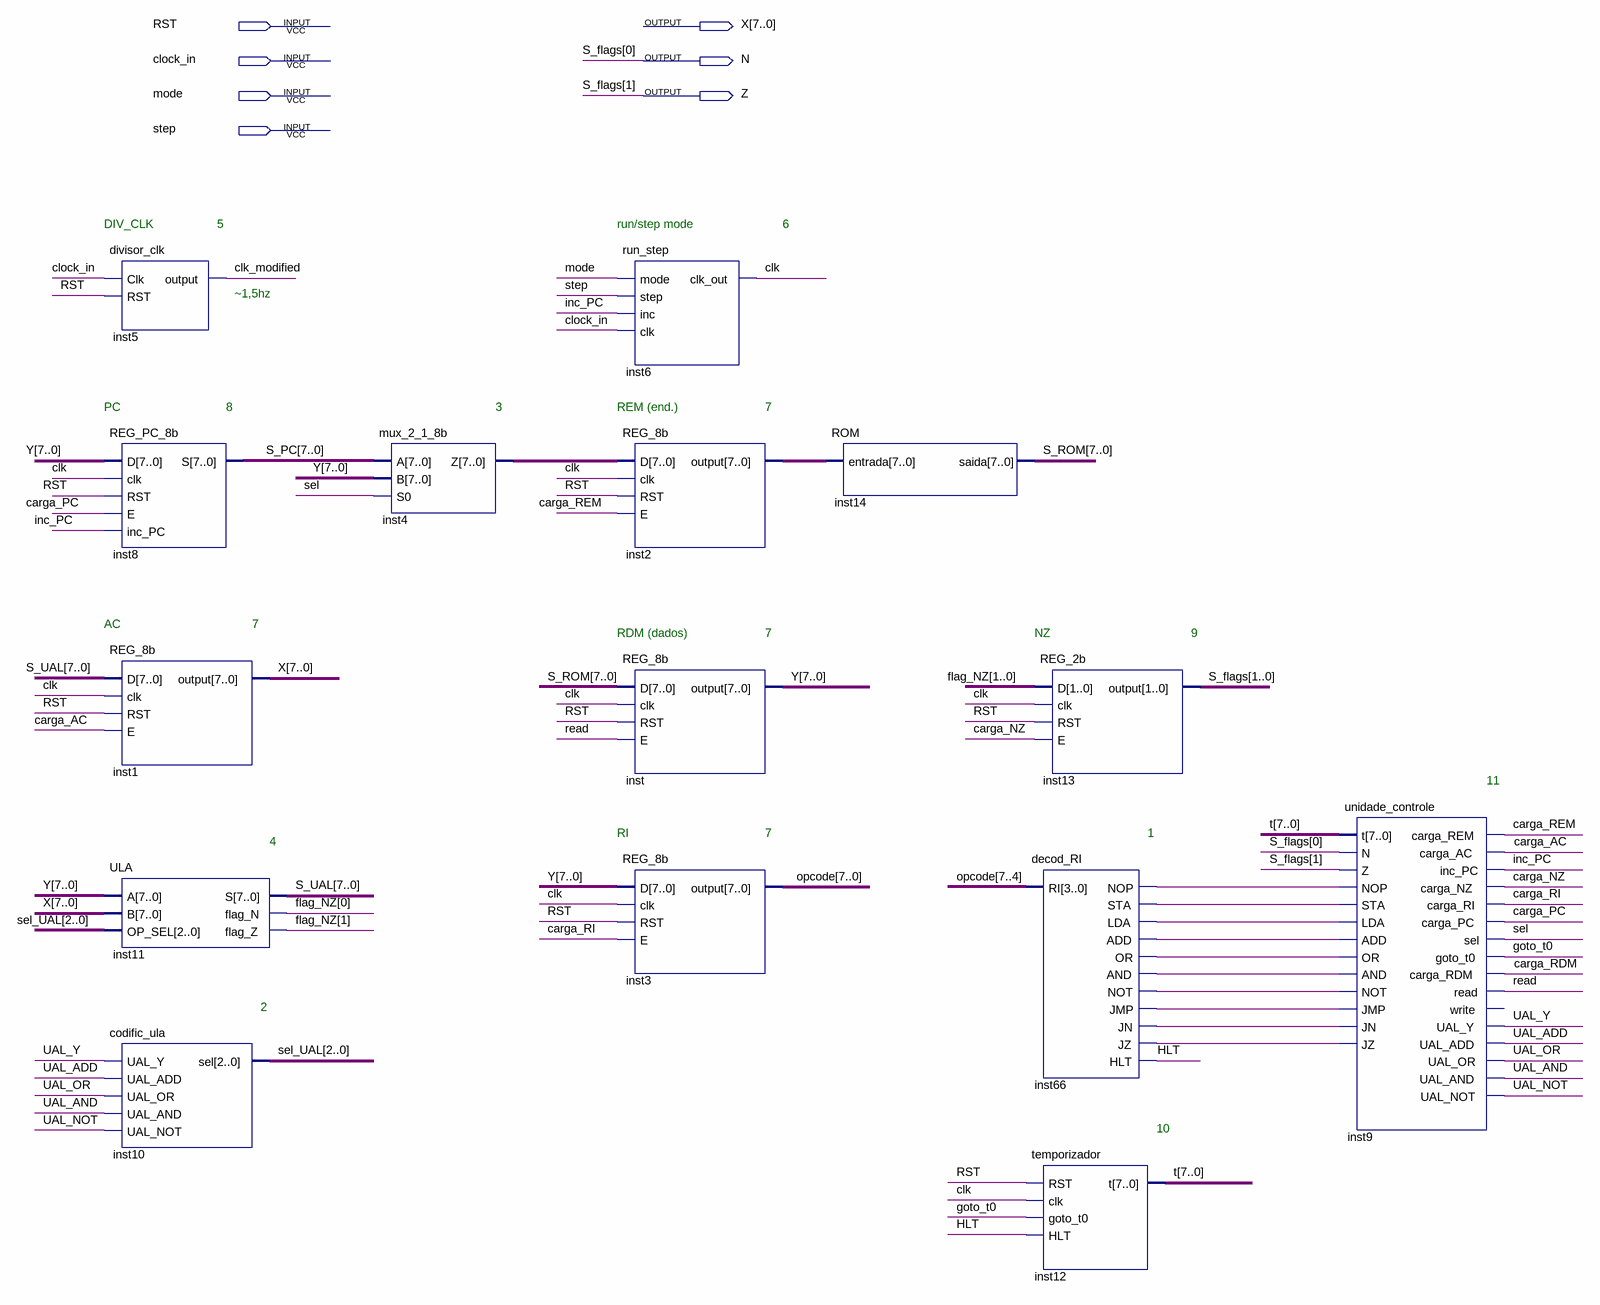
[diagram p0: schematic sheet]
// Quartus schematic NEANDER.bdf as structural Verilog: 15 symbols, 7 pins
module NEANDER (
  input  RST,
  input  clock_in,
  input  mode,
  input  step,
  output [7:0] X,
  output N,
  output Z
);

  wire carga_AC, carga_NZ, carga_PC, carga_RDM, carga_REM, carga_RI, clk, clk_modified, goto_t0, HLT, inc_PC,
       inst66_add, inst66_and, inst66_jmp, inst66_jn, inst66_jz, inst66_lda, inst66_nop, inst66_not,
       inst66_or, inst66_sta, read, sel, UAL_ADD, UAL_AND, UAL_NOT, UAL_OR, UAL_Y;
  wire [1:0] flag_NZ;
  wire [2:0] sel_UAL;
  wire [7:0] inst2_output, inst4_z, opcode, S_PC, S_ROM, S_UAL, t, Y;

  divisor_clk inst5 (.Clk(clock_in), .RST(RST), .\output (clk_modified));
  REG_PC_8b inst8 (.D(Y), .clk(clk), .RST(RST), .E(carga_PC), .inc_PC(inc_PC), .S(S_PC));
  REG_8b inst1 (.D(S_UAL), .clk(clk), .RST(RST), .E(carga_AC), .\output (X));
  ULA inst11 (.A(Y), .B(X), .OP_SEL(sel_UAL), .S(S_UAL), .flag_N(flag_NZ[0]), .flag_Z(flag_NZ[1]));
  codific_ula inst10 (
    .UAL_Y(UAL_Y), .UAL_ADD(UAL_ADD), .UAL_OR(UAL_OR), .UAL_AND(UAL_AND), .UAL_NOT(UAL_NOT), .sel(sel_UAL));
  mux_2_1_8b inst4 (.A(S_PC), .B(Y), .S0(sel), .Z(inst4_z));
  run_step inst6 (.mode(mode), .step(step), .inc(inc_PC), .clk(clock_in), .clk_out(clk));
  REG_8b inst2 (.D(inst4_z), .clk(clk), .RST(RST), .E(carga_REM), .\output (inst2_output));
  REG_8b inst (.D(S_ROM), .clk(clk), .RST(RST), .E(read), .\output (Y));
  REG_8b inst3 (.D(Y), .clk(clk), .RST(RST), .E(carga_RI), .\output (opcode));
  ROM inst14 (.entrada(inst2_output), .saida(S_ROM));
  REG_2b inst13 (.D(flag_NZ), .clk(clk), .RST(RST), .E(carga_NZ), .\output ({Z, N}));
  decod_RI inst66 (
    .RI(opcode[7:4]), .NOP(inst66_nop), .STA(inst66_sta), .LDA(inst66_lda), .ADD(inst66_add), .OR(inst66_or),
    .AND(inst66_and), .NOT(inst66_not), .JMP(inst66_jmp), .JN(inst66_jn), .JZ(inst66_jz), .HLT(HLT));
  temporizador inst12 (.RST(RST), .clk(clk), .goto_t0(goto_t0), .HLT(HLT), .t(t));
  unidade_controle inst9 (
    .t(t), .N(N), .Z(Z), .NOP(inst66_nop), .STA(inst66_sta), .LDA(inst66_lda), .ADD(inst66_add),
    .OR(inst66_or), .AND(inst66_and), .NOT(inst66_not), .JMP(inst66_jmp), .JN(inst66_jn), .JZ(inst66_jz),
    .carga_REM(carga_REM), .carga_AC(carga_AC), .inc_PC(inc_PC), .carga_NZ(carga_NZ), .carga_RI(carga_RI),
    .carga_PC(carga_PC), .sel(sel), .goto_t0(goto_t0), .carga_RDM(carga_RDM), .read(read), .UAL_Y(UAL_Y),
    .UAL_ADD(UAL_ADD), .UAL_OR(UAL_OR), .UAL_AND(UAL_AND), .UAL_NOT(UAL_NOT));  // open: write

  // Other names for the same wires on the sheet: S_flags[1:0] = {Z, N}

  // Notes on the sheet:
  //   DIV_CLK
  //   5
  //   run/step mode
  //   6
  //   ~1,5hz
  //   PC
  //   8
  //   3
  //   REM (end.)
  //   7
  //   AC
  //   7
  //   RDM (dados)
  //   7
  //   NZ
  //   9
  //   11
  //   RI
  //   7
  //   1
  //   4
  //   2
  //   10
endmodule
